# EAGLE design T01_Synth_Glove_v5 (EAGLE 7.1.0)
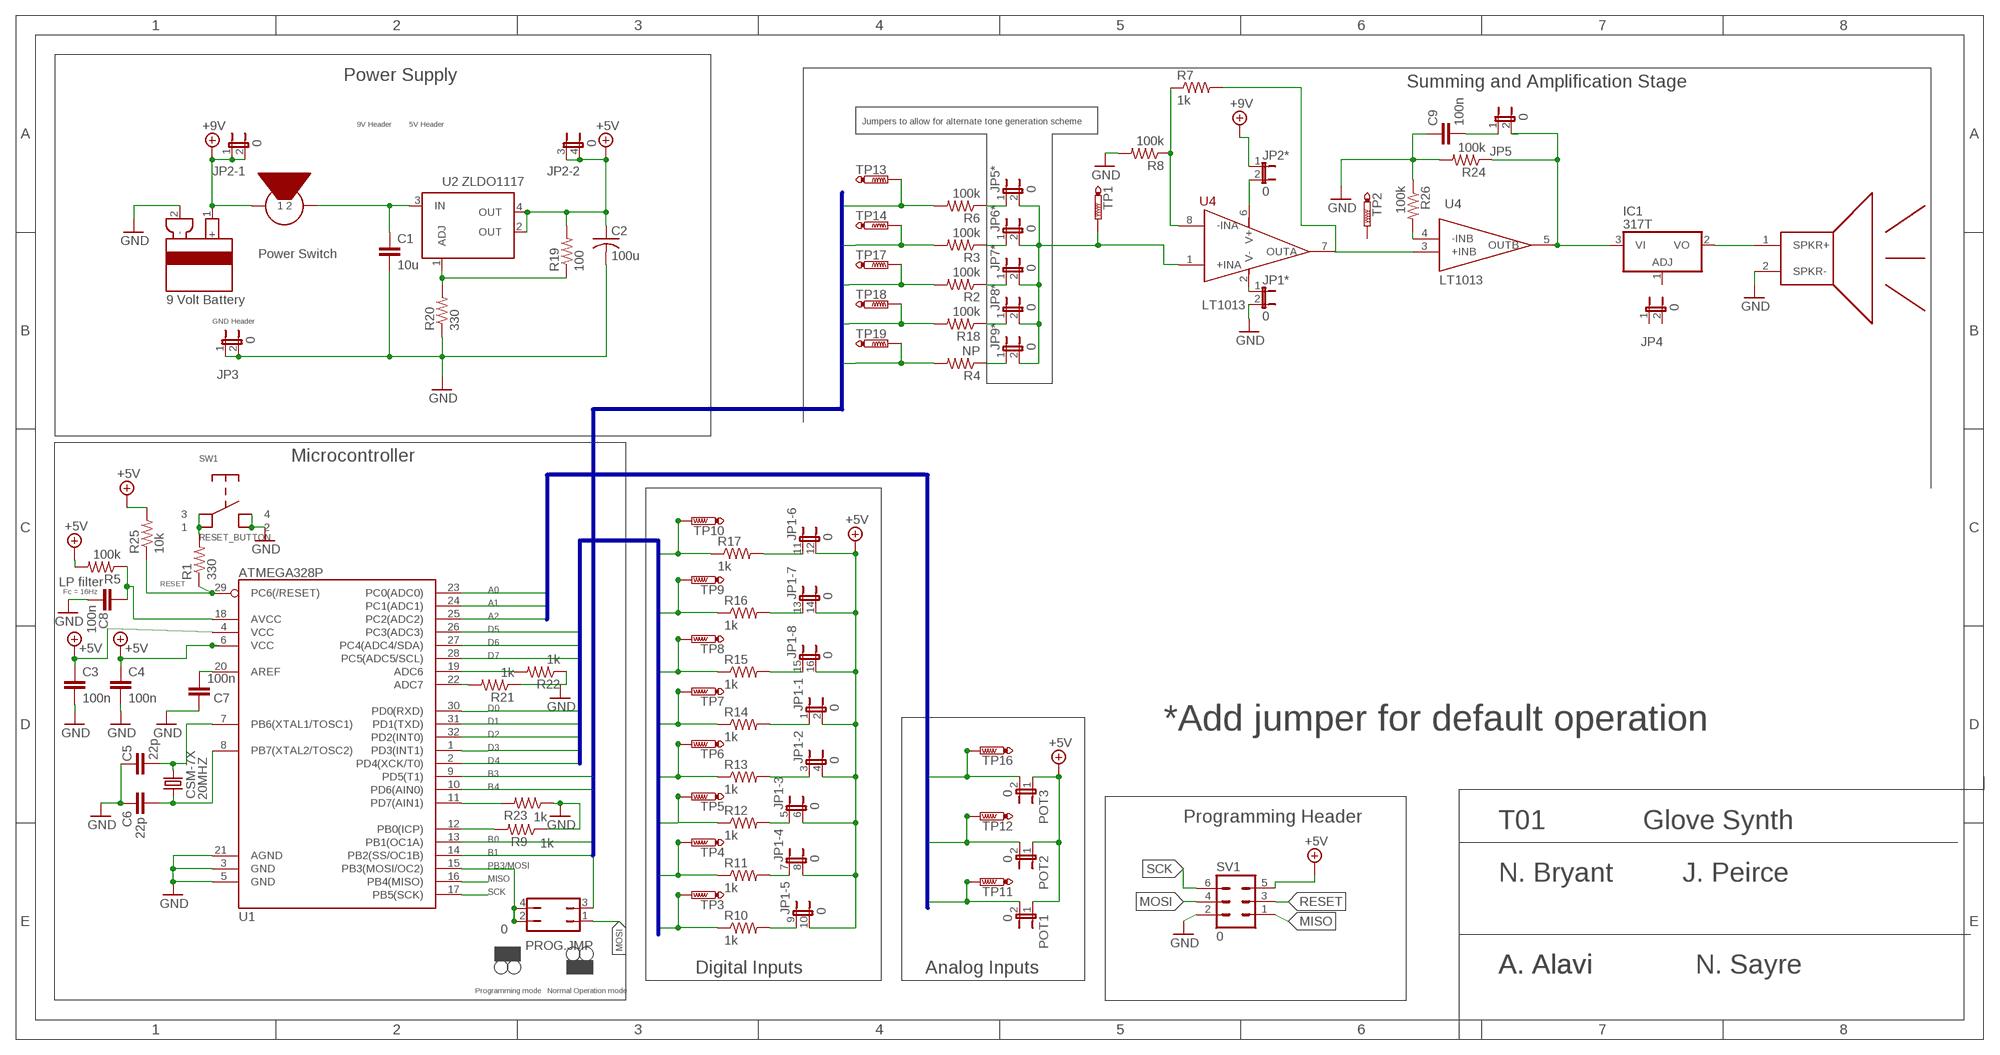
[diagram p0: schematic, sheet 1]

## Parts
20MHZ  CSM-7X  CSM-7X-DU  [CSM-7X-DU]
C1  10u  CAP0603-CAP  [0603-CAP]
C2  100u  C-US075-042X103  [C075-042X103]
C3  100n  CAP0603-CAP  [0603-CAP]
C4  100n  CAP0603-CAP  [0603-CAP]
C5  22p  CAP0603-CAP  [0603-CAP]
C6  22p  CAP0603-CAP  [0603-CAP]
C7  100n  CAP0603-CAP  [0603-CAP]
C8  100n  CAP0603-CAP  [0603-CAP]
C9  100n  CAP0603-CAP  [0603-CAP]
IC1  317T  [TO220H]
JP1  0  JP8QE  [JP8Q]
JP1*  0  JP1E  [JP1]
JP2  0  JP2QE  [JP2Q]
JP2*  0  JP1E  [JP1]
JP3  0  JP1E  [JP1]
JP4  0  JP1E  [JP1]
JP5  0  JP1E  [JP1]
JP5*  0  JP1E  [JP1]
JP6*  0  JP1E  [JP1]
JP7*  0  JP1E  [JP1]
JP8*  0  JP1E  [JP1]
JP9*  0  JP1E  [JP1]
POT1  0  JP1E  [JP1]
POT2  0  JP1E  [JP1]
POT3  0  JP1E  [JP1]
PROG.JMP  0  JP2Q  [JP2Q]
R1  330  RESISTOR0603  [0603-RES]
R2  100k  RESISTOR0603  [0603-RES]
R3  100k  RESISTOR0603  [0603-RES]
R4  NP  RESISTOR0603  [0603-RES]
R5  100k  RESISTOR0603  [0603-RES]
R6  100k  RESISTOR0603  [0603-RES]
R7  1k  RESISTOR0603  [0603-RES]
R8  100k  RESISTOR0603  [0603-RES]
R9  1k  RESISTOR0603  [0603-RES]
R10  1k  RESISTOR0603  [0603-RES]
R11  1k  RESISTOR0603  [0603-RES]
R12  1k  RESISTOR0603  [0603-RES]
R13  1k  RESISTOR0603  [0603-RES]
R14  1k  RESISTOR0603  [0603-RES]
R15  1k  RESISTOR0603  [0603-RES]
R16  1k  RESISTOR0603  [0603-RES]
R17  1k  RESISTOR0603  [0603-RES]
R18  100k  RESISTOR0603  [0603-RES]
R19  100  RESISTOR0603  [0603-RES]
R20  330  RESISTOR0603  [0603-RES]
R21  1k  RESISTOR0603  [0603-RES]
R22  1k  RESISTOR0603  [0603-RES]
R23  1k  RESISTOR0603  [0603-RES]
R24  100k  RESISTOR0603  [0603-RES]
R25  10k  RESISTOR0603  [0603-RES]
R26  100k  RESISTOR0603  [0603-RES]
SV1  0  MA03-2  [MA03-2]
SW1  RESET_BUTTON  [RESET_BUTTON]
TP1  PTR1B2,54  [B2,54]
TP2  PTR1B2,54  [B2,54]
TP3  PTR1B2,54  [B2,54]
TP4  PTR1B2,54  [B2,54]
TP5  PTR1B2,54  [B2,54]
TP6  PTR1B2,54  [B2,54]
TP7  PTR1B2,54  [B2,54]
TP8  PTR1B2,54  [B2,54]
TP9  PTR1B2,54  [B2,54]
TP10  PTR1B2,54  [B2,54]
TP11  PTR1B2,54  [B2,54]
TP12  PTR1B2,54  [B2,54]
TP13  PTR1B2,54  [B2,54]
TP14  PTR1B2,54  [B2,54]
TP16  PTR1B2,54  [B2,54]
TP17  PTR1B2,54  [B2,54]
TP18  PTR1B2,54  [B2,54]
TP19  PTR1B2,54  [B2,54]
U1  ATMEGA328P  ATMEGA328_SMT  [TQFP32-08]
U2  ZLDO1117  [SOT223]
U4  LT1013  [SO08]
U$1  SPEAKER  [JP1]
U$7  POWER_SWITCH  [JP1]
U$8  9VOLTBATTERY  [JP1]

## Nets
+5V: C2.1 C3.1 C4.1 JP1.2 JP1.4 JP1.6 JP1.8 JP1.10 JP1.12 JP1.14 JP1.16 JP2.3 JP2.4 POT1.1 POT2.1 POT3.1 R5.2 R19.2 R25.2 SV1.5 U1.4(VCC) U1.6(VCC) U2.2(OUT) U2.4(OUT)
+9V: JP2*.1 JP2.1 JP2.2 U$7.1 U$8.1(+)
A0: POT1.2 TP11.TP U1.23(PC0(ADC0))
A1: POT2.2 TP12.TP U1.24(PC1(ADC1))
A2: POT3.2 TP16.TP U1.25(PC2(ADC2))
B0: R6.2 TP13.TP U1.13(PB1(OC1A))
B1: R2.2 R3.2 TP14.TP TP17.TP U1.14(PB2(SS/OC1B))
B2: PROG.JMP.3
B3: R18.2 TP18.TP U1.9(PD5(T1))
B4: R4.2 TP19.TP U1.10(PD6(AIN0))
D0: R10.1 TP3.TP U1.30(PD0(RXD))
D1: R11.1 TP4.TP U1.31(PD1(TXD))
D2: R12.1 TP5.TP U1.32(PD2(INT0))
D3: R13.1 TP6.TP U1.1(PD3(INT1))
D4: R14.1 TP7.TP U1.2(PD4(XCK/T0))
D5: R15.1 TP8.TP U1.26(PC3(ADC3))
D6: R16.1 TP9.TP U1.27(PC4(ADC4/SDA))
D7: R17.1 TP10.TP U1.28(PC5(ADC5/SCL))
GND: C1.2 C2.2 C3.2 C4.2 C5.2 C6.2 C7.2 C8.2 C9.1 JP1*.2 JP3.1 JP3.2 R8.2 R9.1 R20.1 R21.1 R22.1 R23.1 R24.2 R26.1 SV1.2 SW1.2 SW1.4 U1.3(GND) U1.5(GND) U1.21(AGND) U$1.2(SPKR-) U$8.2(-)
MISO: SV1.1 U1.16(PB4(MISO))
MOSI: PROG.JMP.1 SV1.4
N$1: C7.1 U1.20(AREF)
N$2: JP5*.2 JP6*.2 JP7*.2 JP8*.2 JP9*.2 TP1.TP U4.1(+INA)
N$3: JP1.9 R10.2
N$4: JP1.7 R11.2
N$5: JP1.5 R12.2
N$6: 20MHZ.1 C5.1 U1.7(PB6(XTAL1/TOSC1))
N$7: 20MHZ.2 C6.1 U1.8(PB7(XTAL2/TOSC2))
N$8: C8.1 R5.1 U1.18(AVCC)
N$9: R21.2 U1.22(ADC7)
N$10: R22.2 U1.19(ADC6)
N$11: JP1.3 R13.2
N$12: JP1.1 R14.2
N$13: JP1.15 R15.2
N$15: JP1.13 R16.2
N$16: R7.1 R8.1 U4.8(-INA)
N$17: R9.2 U1.12(PB0(ICP))
N$18: JP5*.1 R6.1
N$21: JP6*.1 R3.1
N$22: R1.2 SW1.1 SW1.3
N$23: JP1.11 R17.2
N$25: JP7*.1 R2.1
N$26: R26.2 U4.4(-INB)
N$27: JP8*.1 R18.1
N$31: IC1.2(VO) U$1.1(SPKR+)
N$32: JP9*.1 R4.1
N$34: JP2*.2 U4.6(V+)
N$35: R7.2 U4.7(OUTA)
N$36: U4.3(+INB)
N$37: R19.1 R20.2 U2.1(ADJ)
N$38: C1.1 U2.3(IN) U$7.2
N$39: C9.2 JP5.1
N$40: IC1.3(VI) JP5.2 R24.1 U4.5(OUTB)
PB3/MOSI: PROG.JMP.2 PROG.JMP.4 U1.15(PB3(MOSI/OC2))
PD7: R23.2 U1.11(PD7(AIN1))
RESET: R1.1 R25.1 SV1.3 U1.29(PC6(/RESET))
SCK: SV1.6 U1.17(PB5(SCK))
V-: JP1*.1 U4.2(V-)
Unconnected: IC1.1(ADJ) JP4.1 JP4.2 TP2.TP

## Buses
B[0..4]
D[0..7]
A[0..2]

## Notes on the sheet
- Power Supply
- Summing and Amplification Stage
- Jumpers to allow for alternate tone generation scheme
- 9V Header | 5V Header
- Power Switch
- GND Header
- Microcontroller
- LP filter
- Fc = 16Hz
- *Add jumper for default operation
- Programming Header
- T01 | Glove Synth
- N. Bryant | J. Peirce
- Digital Inputs | Analog Inputs
- A. Alavi | A. Alavi | N. Sayre
- Programming mode | Normal Operation mode

## Library data of the parts
20MHZ = crystal:CSM-7X-DU: SMD CRYSTAL Source: www.ecsxtal.com .. Crystal 3.6864MHz CSM_7X_DU.PDF; OC_FARNELL: unknown; OC_NEWARK: unknown
C1 C3-C9 = SparkFun-Capacitors:CAP: Capacitor Standard 0603 ceramic capacitor, and 0.1" leaded capacitor.
C2 = adafruit:C-US: CAPACITOR, American symbol
IC1 = linear:*317: Positive VOLTAGE REGULATOR
JP1 = jumper:JP8QE: JUMPER
JP1* JP2* JP3-JP5 JP5* JP6* JP7* JP8* JP9* POT1-POT3 = jumper:JP1E: JUMPER
JP2 = jumper:JP2QE: JUMPER
PROG.JMP = jumper:JP2Q: JUMPER
R1-R26 = SparkFun-Resistors:RESISTOR: Resistor Basic schematic elements and footprints for 0603, 1206, and PTH resistors.
SV1 = con-lstb:MA03-2: PIN HEADER; OC_FARNELL: unknown; OC_NEWARK: unknown
SW1 = Synth_Glove:RESET_BUTTON: Single pole push button
TP1-TP14 TP16-TP19 = testpad:PTR1: TEST PIN
U1 = SparkFun-DigitalIC:ATMEGA328_SMT: 32-Pin Atmega328 part Commonly used on Arduino compatible boards Available in QFP and QFN packages TQFP is IC-09069 QFN is non-stock; PROD_ID: IC-09069
U2 = Synth_Glove:ZLDO1117
U4 = Synth_Glove:LT1013: Linear Technology dual input precision op amps
U$1 = Synth_Glove:SPEAKER
U$7 = Synth_Glove:POWER_SWITCH
U$8 = Synth_Glove:9VOLTBATTERY

## Board
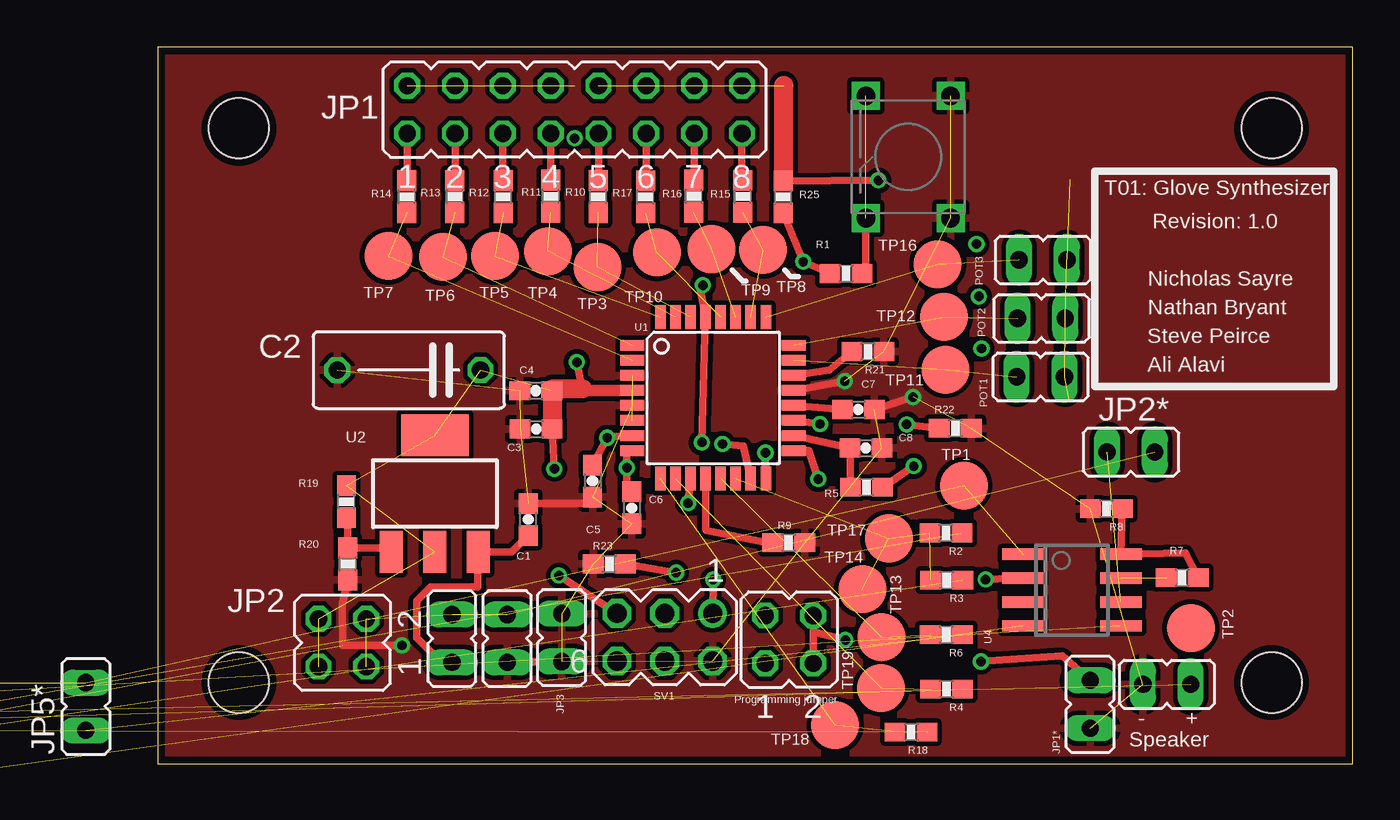
[diagram p1: board, top side]
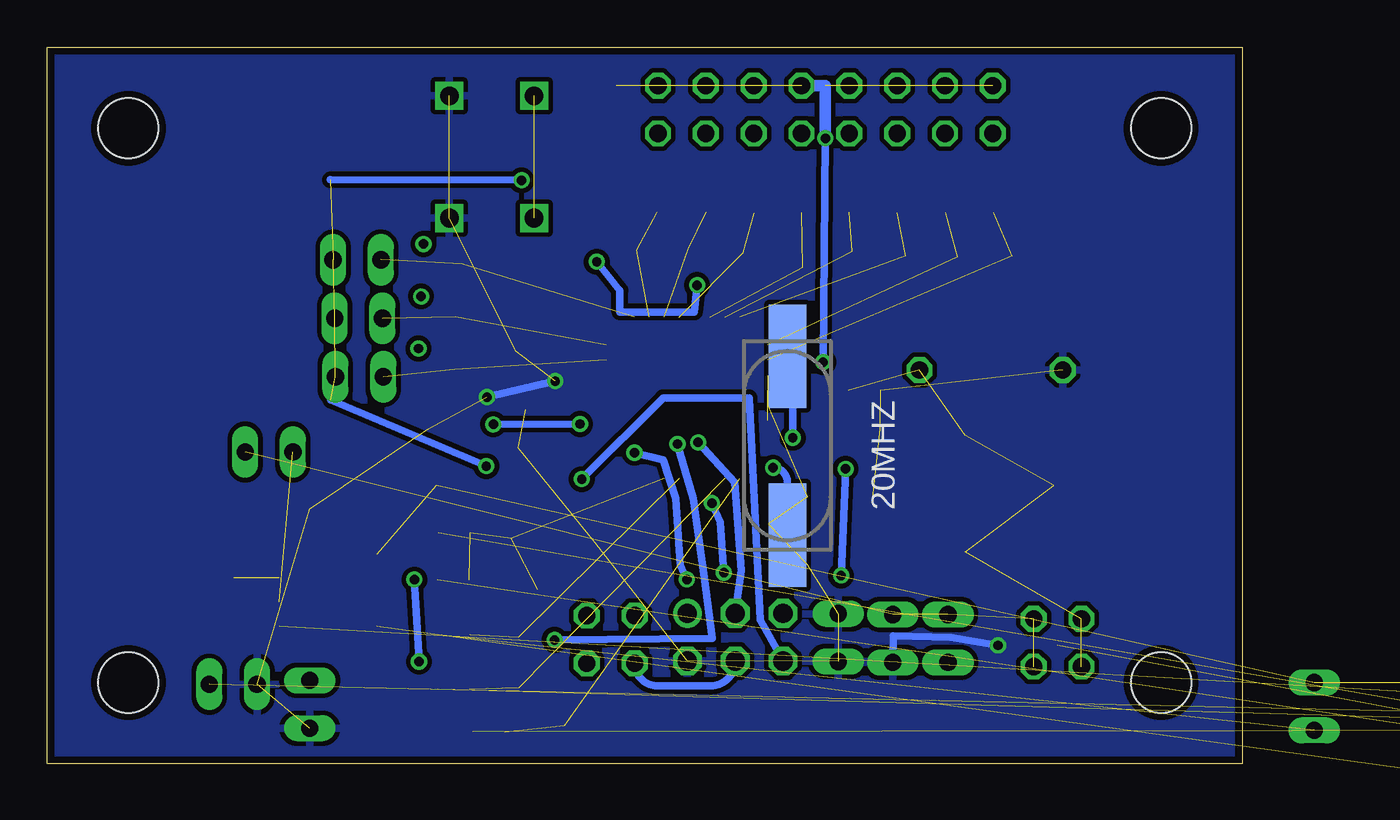
[diagram p2: board, bottom side, seen from below]

Size 63.5 x 38.1 mm. Coordinates in mm from the lower left corner, seen from the top.
Outline: 0,0 63.5,0 63.5,38.1 0,38.1 0,0
Copper layers (1*16): Top 0.0356mm / dielectric 1.5011mm / Bottom 0.0356mm
Design rules "OSH-Park-2-layer": minimum track width 6mil, minimum drill 13mil, track to track 6mil, track to pad 6mil, pad to pad 6mil, via to via 6mil, smd to smd 6mil, copper to edge 15mil, drill to drill 6mil, minimum pad ring 7mil, minimum via ring 7mil, stop-mask expansion 3mil, vias tented up to drill 0mil, thermal gap 10mil
Holes 3.2 mm at 4.32,4.32 59.18,33.78 4.32,33.78 59.18,4.32

### Footprints (pad centres in the part's own frame; a part is rotated, then mirrored left to right if it is on the bottom)
CSM-7X-DU = smd 5.5 x 2: 1 -4.75,0; 2 4.75,0
0603-CAP = smd 1.1 x 1: 1 -0.85,0; 2 0.85,0
C075-042X103 = drill 0.914 octagon: 1 -3.81,0; 2 3.81,0
TO220H = drill 1.118 long: 1 -2.54,-10.16; 2 0,-10.16; 3 2.54,-10.16 | hole 3.302: 0,4.826
JP8Q = drill 0.914 octagon: 1 -8.89,-1.27; 2 -8.89,1.27; 3 -6.35,-1.27; 4 -6.35,1.27; 5 -3.81,-1.27; 6 -3.81,1.27; 7 -1.27,-1.27; 8 -1.27,1.27; 9 1.27,-1.27; 10 1.27,1.27; 11 3.81,-1.27; 12 3.81,1.27; 13 6.35,-1.27; 14 6.35,1.27; 15 8.89,-1.27; 16 8.89,1.27
JP1 = drill 0.914 long: 1 0,-1.27; 2 0,1.27
JP2Q = drill 0.914 octagon: 1 -1.27,-1.27; 2 1.27,-1.27; 3 -1.27,1.27; 4 1.27,1.27
0603-RES = smd 1.1 x 1: 1 -0.85,0; 2 0.85,0
MA03-2 = drill 1.016: 1 -2.54,-1.27 | drill 1.016 octagon: 2 -2.54,1.27; 3 0,-1.27; 4 0,1.27; 5 2.54,-1.27; 6 2.54,1.27
RESET_BUTTON = drill 0.991 square: 1 3.251,2.248; 2 3.251,-2.248; 3 -3.251,2.248; 4 -3.251,-2.248
B2,54 = smd 2.54 x 2.54: TP 0,0
TQFP32-08 = smd 1.27 x 0.559: 1 -4.293,2.8; 2 -4.293,2; 3 -4.293,1.2; 4 -4.293,0.4; 5 -4.293,-0.4; 6 -4.293,-1.2; 7 -4.293,-2; 8 -4.293,-2.8; 17 4.293,-2.8; 18 4.293,-2; 19 4.293,-1.2; 20 4.293,-0.4; 21 4.293,0.4; 22 4.293,1.2; 23 4.293,2; 24 4.293,2.8 | smd 0.559 x 1.27: 9 -2.8,-4.293; 10 -2,-4.293; 11 -1.2,-4.293; 12 -0.4,-4.293; 13 0.4,-4.293; 14 1.2,-4.293; 15 2,-4.293; 16 2.8,-4.293; 25 2.8,4.293; 26 2,4.293; 27 1.2,4.293; 28 0.4,4.293; 29 -0.4,4.293; 30 -1.2,4.293; 31 -2,4.293; 32 -2.8,4.293
SOT223 = smd 1.219 x 2.235: 1 -2.311,-3.099; 2 0,-3.099; 3 2.311,-3.099 | smd 3.6 x 2.2: 4 0,3.099
SO08 = smd 0.6 x 2.2: 1 -1.905,-2.6; 2 -0.635,-2.6; 3 0.635,-2.6; 4 1.905,-2.6; 5 1.905,2.6; 6 0.635,2.6; 7 -0.635,2.6; 8 -1.905,2.6

### Placement (x,y rotation side)
20MHZ  24.18,16.91 270 bottom
C1  19.69,12.98 90 top
C2  13.35,20.93 180 top
C3  20.11,17.79 180 top
C4  20.09,19.83 180 top
C5  23.11,15.03 270 top
C6  25.19,13.61 270 top
C7  37.23,18.83 0 top
C8  37.63,16.78 0 top
C9  -48.77,-1.52 0 top  (outside the outline)
IC1  -42.67,12.19 0 top  (outside the outline)
JP1  22.16,34.78 0 top
JP1*  49.54,3.16 180 top
JP2  9.82,6.44 90 top
JP2*  51.71,16.57 90 top
JP3  21.47,6.71 180 top
JP4  -54.1,-3.05 0 top  (outside the outline)
JP5  -60.96,-3.05 0 top  (outside the outline)
JP5*  -3.81,3.05 0 top  (outside the outline)
JP6*  -10.67,3.05 0 top  (outside the outline)
JP7*  -17.53,3.05 0 top  (outside the outline)
JP8*  -24.38,3.05 0 top  (outside the outline)
JP9*  -31.24,3.05 0 top  (outside the outline)
POT1  46.91,20.57 90 top
POT2  46.95,23.68 90 top
POT3  47.04,26.79 90 top
PROG.JMP  33.55,6.61 0 top
R1  36.58,26.06 0 top
R2  41.88,12.27 180 top
R3  41.93,9.77 180 top
R4  41.9,3.97 180 top
R5  37.66,14.7 0 top
R6  41.89,6.87 180 top
R7  54.43,9.9 180 top
R8  50.41,13.56 180 top
R9  33.53,11.75 180 top
R10  23.41,30.14 90 top
R11  20.88,30.17 90 top
R12  18.37,30.14 90 top
R13  15.8,30.15 90 top
R14  13.24,30.14 90 top
R15  31.09,30.16 90 top
R16  28.49,30.18 90 top
R17  25.93,30.13 90 top
R18  40.03,1.69 180 top
R19  10.04,13.94 90 top
R20  10.11,10.63 90 top
R21  37.74,21.91 180 top
R22  42.38,17.84 180 top
R23  24,10.63 0 top
R24  -48.77,-4.57 0 top  (outside the outline)
R25  33.23,30.13 90 top
R26  -62.74,-7.62 0 top  (outside the outline)
SV1  26.95,6.73 180 top
SW1  39.88,32.26 90 top
TP1  42.83,14.79 0 top
TP2  54.89,7.21 0 top
TP3  23.36,26.41 180 top
TP4  20.73,27.24 180 top
TP5  17.92,27 180 top
TP6  15.15,26.94 180 top
TP7  12.27,26.99 180 top
TP8  32.17,27.31 180 top
TP9  29.43,27.36 180 top
TP10  26.53,27.18 180 top
TP11  41.85,20.96 0 top
TP12  41.78,23.76 0 top
TP13  38.46,6.73 0 top
TP14  37.44,9.28 0 top
TP16  41.43,26.55 0 top
TP17  38.85,11.98 0 top
TP18  35.99,2.06 0 top
TP19  38.43,4.04 0 top
U1  29.51,19.45 0 top
U2  14.74,14.36 0 top
U4  48.57,9.24 270 top
U$1  53.61,4.23 90 top
U$7  15.65,6.66 180 top
U$8  18.58,6.66 180 top

### Tracks (layer width: path | path; a pad name or v marks a point on that pad's centre or on a via)
+5V  (via drill 0.5)  (20 unrouted)
  Top 0.406: U1.4 25.02,19.85 | 20.95,19.85 C4.1 | R25.2 v38.29,31.02 | v40.17,15.82 R5.2 | 22.58,19.87 22.56,19.94 v22.27,21.35 | SV1.5 v21.32,10.01 | v21.08,15.68 C3.1
  Top 0.61: 22.58,19.87 arc90 22.6,19.85 U1.4
  Top 1.016: R25.2 arc90 33.27,31.02 33.27,36.07 arc-90 33.26,36.05 | 20.95,19.85 arc-90 20.96,19.84 C3.1 | C4.1 arc-90 21.05,19.94 22.56,19.94
  Bottom 0.406: v40.17,15.82 48.42,19.33 | v38.29,31.02 48.46,31.05 | v21.32,10.01 v21.08,15.68 | v22.27,21.35 v22.15,33.25
  Bottom 0.61: v22.15,33.25 arc90 22.17,33.27 22.17,36.03 | 22.17,36.03 arc90 22.15,36.05 | 23.41,36.03 22.17,36.03
+9V  (4 unrouted)
A0  (2 unrouted)
A1  (2 unrouted)
A2  (2 unrouted)
B0  (2 unrouted)
B1  (4 unrouted)
B3  (2 unrouted)
B4  (2 unrouted)
D0  (2 unrouted)
D1  (2 unrouted)
D2  (2 unrouted)
D3  (2 unrouted)
D4  (2 unrouted)
D5  (2 unrouted)
D6  (2 unrouted)
D7  (2 unrouted)
GND  (via drill 0.5)  (23 unrouted)
  Top 0.406: JP3.2 U$8.2 | v12.99,6.3 10.65,6.3 9.85,6.3 9.82,8.48 R20.1 | C5.2 arc-90 22.76,13.83 C1.2 | U1.21 v36.51,20.34 | v40.13,19.49 C7.2
  Bottom 0.406: v36.51,20.34 v40.13,19.49 | v12.99,6.3 15.49,6.73 18.54,6.79 U$8.2
  pour Bottom (isolate 0.254): 0,38.1 63.5,38.1 63.5,0 0,0
  pour Top (isolate 0.254): 0,0 63.5,0 63.5,38.1 0,38.1
MISO  (via drill 0.5)
  Top 0.406: SV1.1 v29.51,9.8 | v32.3,16.54 U1.16
  Bottom 0.406: v29.51,9.8 29.86,10.56 30.12,14.12 30.78,16.15 v32.3,16.54
MOSI
  Bottom 0.406: SV1.4 arc90 28.26,4.15 31.09,4.15 arc90 PROG.JMP.1
N$1
  Top 0.406: U1.20 C7.1
N$2  (6 unrouted)
N$3
  Top 0.406: JP1.9 23.43,31.01 R10.2
N$4
  Top 0.406: JP1.7 R11.2
N$5
  Top 0.406: JP1.5 18.34,31.02 R12.2
N$6  (via drill 0.5)
  Top 0.406: U1.7 24.31,17.41 v23.89,17.34 C5.1
  Bottom 0.406: v23.89,17.34 23.92,21.41 20MHZ.1
N$7  (via drill 0.5)
  Top 0.406: U1.8 arc90 24.93,16.37 v24.93,15.74 24.93,14.72 arc90 C6.1
  Bottom 0.406: v24.93,15.74 arc90 24.18,14.98 20MHZ.2
N$8
  Top 0.406: U1.18 C8.1 R5.1
N$9
  Top 0.406: U1.22 35.68,20.94 R21.2
N$10  (via drill 0.5)
  Top 0.406: U1.19 v35.19,18.07 | v39.8,18.04 R22.2
  Bottom 0.406: v35.19,18.07 v39.8,18.04
N$11
  Top 0.406: JP1.3 R13.2
N$12
  Top 0.406: JP1.1 13.27,31.02 R14.2
N$13
  Top 0.406: JP1.15 31.05,31.06 R15.2
N$15
  Top 0.406: JP1.13 28.5,31.04 R16.2
N$16
  Top 0.406: R7.1 54.6,11.21 U4.8 R8.1
N$17
  Top 0.406: R9.2 32.32,11.78 29.14,12.41 29.11,12.43 U1.12
N$18  (1 unrouted)
N$21  (1 unrouted)
N$22  (1 unrouted)
  Top 0.406: R1.2 37.63,26.06 SW1.3
N$23
  Top 0.406: JP1.11 25.96,31.02 R17.2
N$25  (1 unrouted)
N$26  (1 unrouted)
N$27  (1 unrouted)
N$28  (via drill 0.5)
  other vias: 43.5,27.63
N$29  (via drill 0.5)
  other vias: 43.63,24.84
N$30  (via drill 0.5)
  other vias: 43.77,22.07
N$31  (1 unrouted)
N$32  (1 unrouted)
N$34  (1 unrouted)
N$35  (1 unrouted)
N$37
  Top 0.406: U2.1 12.42,11.48 R20.2 10.11,13.09 R19.1
N$38
  Top 0.406: U$7.2 15.07,5.39 13.77,6.69 13.77,8.67 14.51,9.4 17,9.4 17.01,9.41 17.01,11.23 U2.3 18.82,11.27 C1.1
N$39  (1 unrouted)
N$40  (3 unrouted)
PB3/MOSI  (via drill 0.5)
  Top 0.406: PROG.JMP.4 34.83,7 | 34.83,7 PROG.JMP.2 | v30.01,17 31.11,16.9 U1.15 | v36.54,6.59 34.83,7
  Bottom 0.406: v30.01,17 29.17,14.1 28.56,9.72 28.17,6.66 v36.54,6.59
PD7  (via drill 0.5)
  Top 0.406: U1.11 v28.18,13.86 | v27.55,10.16 R23.2
  Bottom 0.406: v28.18,13.86 27.73,12.85 v27.55,10.16
RESET  (via drill 0.5)
  Top 0.406: v28.97,25.44 arc-90 28.79,25.47 U1.29 29.1,23.73 v28.91,17.08 | R1.1 v34.3,26.69 R25.1
  Bottom 0.406: v28.97,25.44 29.11,24.02 33.07,24.02 33.07,25.16 v34.3,26.69 | v28.91,17.08 26.97,14.96 26.64,10.28 SV1.3
SCK  (via drill 0.5)
  Top 0.406: v35.1,15.13 34.6,16.65 U1.17
  Bottom 0.406: SV1.6 25.62,7.64 26.21,19.45 30.78,19.45 v35.1,15.13
V-  (via drill 0.5)
  Top 0.406: JP1*.1 48.05,5.74 v43.74,5.44 | v43.99,9.8 U4.2
  Bottom 0.406: v43.74,5.44 v43.99,9.8

### Text on the board
tPlace: T01: Glove Synthesizer | Revision: 1.0 | Nicholas Sayre | Nathan Bryant | Steve Peirce | Ali Alavi | Programming jumper | - | + | Speaker